# Altium schematic sheet DDR4.schdoc
size 492 x 319 mm
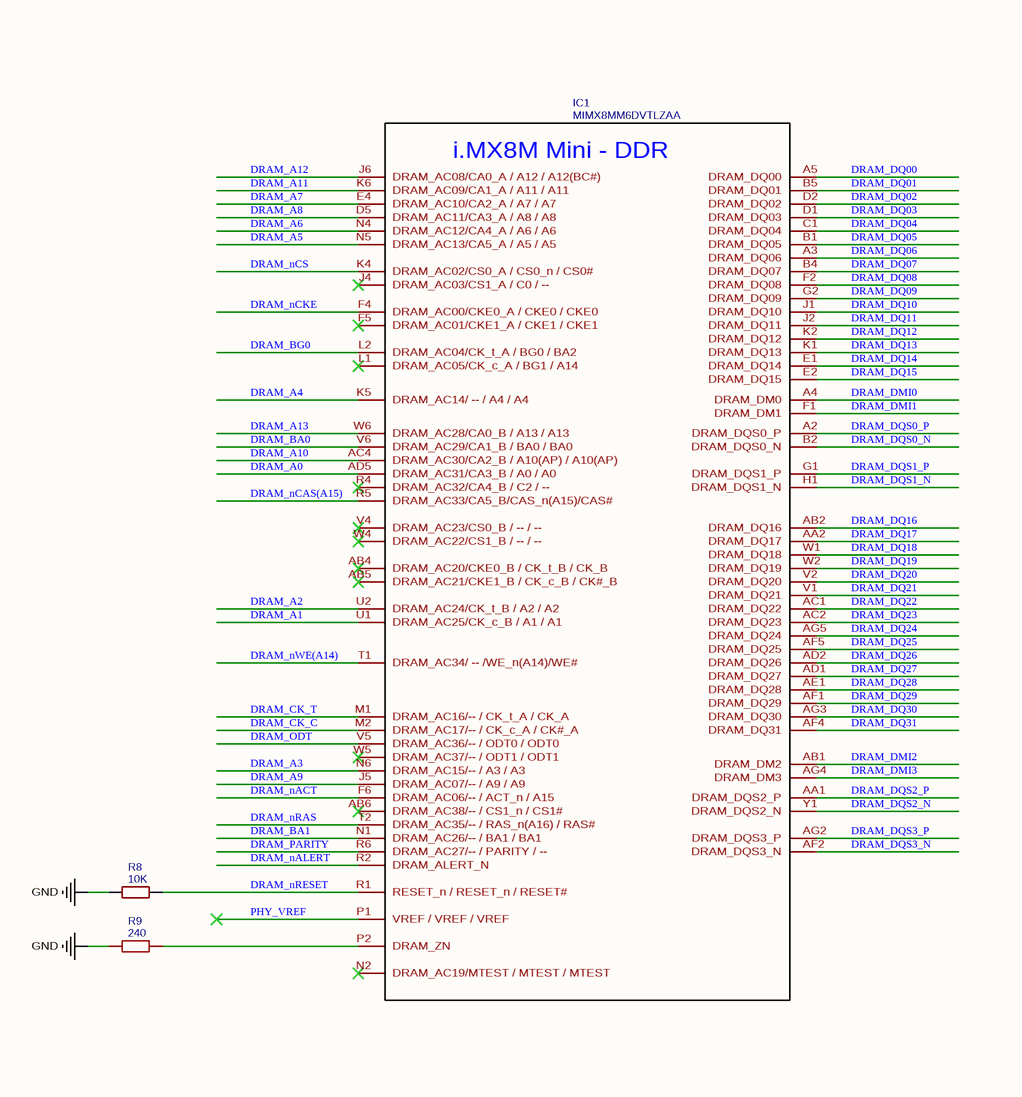
[diagram p0: DDR4.schdoc, left]
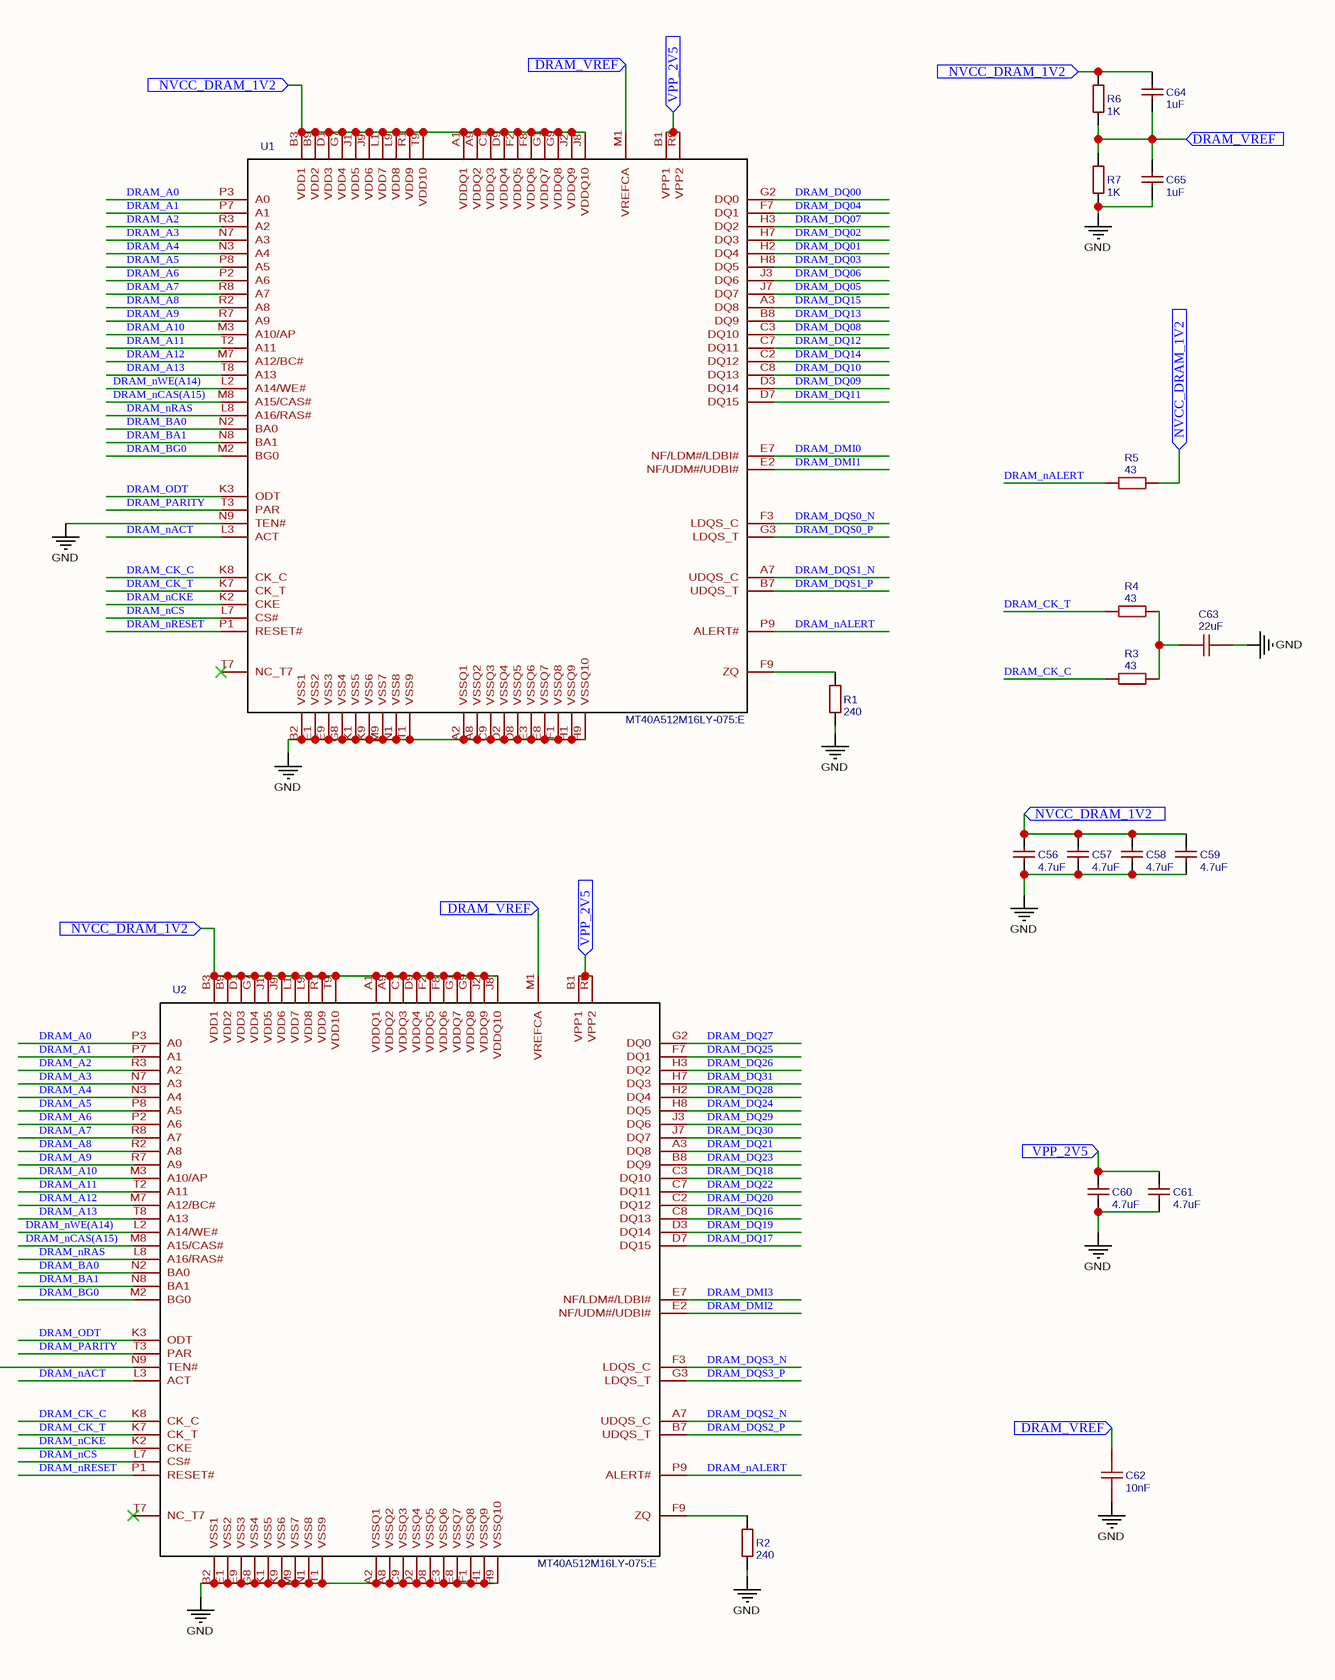
[diagram p1: DDR4.schdoc, right]

## Parts
C56  4.7uF  [C0402]
C57  4.7uF  [C0402]
C58  4.7uF  [C0402]
C59  4.7uF  [C0402]
C60  4.7uF  [C0402]
C61  4.7uF  [C0402]
C62  10nF  [C0603]
C63  22uF  [C0603]
C64  1uF  [C0402]
C65  1uF  [C0402]
IC1  MIMX8MM6DVTLZAA  [BGA486C50P27X27_1400X1400X125]
R1  240  [R0603]
R2  240  [R0603]
R3  43  [R0402]
R4  43  [R0402]
R5  43  [R0402]
R6  1K  [R0402]
R7  1K  [R0402]
R8  10K  [R0603]
R9  240  [R0402]
U1  MT40A512M16LY-075:E  [FBGA-96_L13.5-W7.5-R16-C6-P0.80-TL]
U2  MT40A512M16LY-075:E  [FBGA-96_L13.5-W7.5-R16-C6-P0.80-TL]

## Ports
DRAM_VREF (in), NVCC_DRAM_1V2 (in), VPP_2V5 (in)

## Nets
GND: C56.1 C57.1 C58.1 C59.1 C60.1 C61.1 C62.1 C63.2 C65.1 R1.1 R2.1 R7.1 R8.1 R9.1 U1.A2(VSSQ1) U1.A8(VSSQ2) U1.B2(VSS1) U1.C9(VSSQ3) U1.D2(VSSQ4) U1.D8(VSSQ5) U1.E1(VSS2) U1.E3(VSSQ6) U1.E8(VSSQ7) U1.E9(VSS3) U1.F1(VSSQ8) U1.G8(VSS4) U1.H1(VSSQ9) U1.H9(VSSQ10) U1.K1(VSS5) U1.K9(VSS6) U1.M9(VSS7) U1.N1(VSS8) U1.N9(TEN#) U1.T1(VSS9) U2.A2(VSSQ1) U2.A8(VSSQ2) U2.B2(VSS1) U2.C9(VSSQ3) U2.D2(VSSQ4) U2.D8(VSSQ5) U2.E1(VSS2) U2.E3(VSSQ6) U2.E8(VSSQ7) U2.E9(VSS3) U2.F1(VSSQ8) U2.G8(VSS4) U2.H1(VSSQ9) U2.H9(VSSQ10) U2.K1(VSS5) U2.K9(VSS6) U2.M9(VSS7) U2.N1(VSS8) U2.T1(VSS9)
DRAM_A0: IC1.AD5(DRAM_AC31/CA3_B_/_A0_/_A0) U1.P3(A0) U2.P3(A0)
DRAM_A1: IC1.U1(DRAM_AC25/CK_c_B_/_A1_/_A1) U1.P7(A1) U2.P7(A1)
DRAM_A2: IC1.U2(DRAM_AC24/CK_t_B_/_A2_/_A2) U1.R3(A2) U2.R3(A2)
DRAM_A3: IC1.N6(DRAM_AC15/--_/_A3_/_A3) U1.N7(A3) U2.N7(A3)
DRAM_A4: IC1.K5(DRAM_AC14/_--_/_A4_/_A4) U1.N3(A4) U2.N3(A4)
DRAM_A5: IC1.N5(DRAM_AC13/CA5_A_/_A5_/_A5) U1.P8(A5) U2.P8(A5)
DRAM_A6: IC1.N4(DRAM_AC12/CA4_A_/_A6_/_A6) U1.P2(A6) U2.P2(A6)
DRAM_A7: IC1.E4(DRAM_AC10/CA2_A_/_A7_/_A7) U1.R8(A7) U2.R8(A7)
DRAM_A8: IC1.D5(DRAM_AC11/CA3_A_/_A8_/_A8) U1.R2(A8) U2.R2(A8)
DRAM_A9: IC1.J5(DRAM_AC07/--_/_A9_/_A9) U1.R7(A9) U2.R7(A9)
DRAM_A10: IC1.AC4(DRAM_AC30/CA2_B_/_A10(AP)_/_A10(AP)) U1.M3(A10/AP) U2.M3(A10/AP)
DRAM_A11: IC1.K6(DRAM_AC09/CA1_A_/_A11_/_A11) U1.T2(A11) U2.T2(A11)
DRAM_A12: IC1.J6(DRAM_AC08/CA0_A_/_A12_/_A12(BC#)) U1.M7(A12/BC#) U2.M7(A12/BC#)
DRAM_A13: IC1.W6(DRAM_AC28/CA0_B_/_A13_/_A13) U1.T8(A13) U2.T8(A13)
DRAM_BA0: IC1.V6(DRAM_AC29/CA1_B_/_BA0_/_BA0) U1.N2(BA0) U2.N2(BA0)
DRAM_BA1: IC1.N1(DRAM_AC26/--_/_BA1_/_BA1) U1.N8(BA1) U2.N8(BA1)
DRAM_BG0: IC1.L2(DRAM_AC04/CK_t_A_/_BG0_/_BA2) U1.M2(BG0) U2.M2(BG0)
DRAM_CK_C: IC1.M2(DRAM_AC17/--_/_CK_c_A_/_CK#_A) R3.1 U1.K8(CK_C) U2.K8(CK_C)
DRAM_CK_T: IC1.M1(DRAM_AC16/--_/_CK_t_A_/_CK_A) R4.1 U1.K7(CK_T) U2.K7(CK_T)
DRAM_DMI0: IC1.A4(DRAM_DM0) U1.E7(NF/LDM#/LDBI#)
DRAM_DMI1: IC1.F1(DRAM_DM1) U1.E2(NF/UDM#/UDBI#)
DRAM_DMI2: IC1.AB1(DRAM_DM2) U2.E2(NF/UDM#/UDBI#)
DRAM_DMI3: IC1.AG4(DRAM_DM3) U2.E7(NF/LDM#/LDBI#)
DRAM_DQ00: IC1.A5(DRAM_DQ00) U1.G2(DQ0)
DRAM_DQ01: IC1.B5(DRAM_DQ01) U1.H2(DQ4)
DRAM_DQ02: IC1.D2(DRAM_DQ02) U1.H7(DQ3)
DRAM_DQ03: IC1.D1(DRAM_DQ03) U1.H8(DQ5)
DRAM_DQ04: IC1.C1(DRAM_DQ04) U1.F7(DQ1)
DRAM_DQ05: IC1.B1(DRAM_DQ05) U1.J7(DQ7)
DRAM_DQ06: IC1.A3(DRAM_DQ06) U1.J3(DQ6)
DRAM_DQ07: IC1.B4(DRAM_DQ07) U1.H3(DQ2)
DRAM_DQ08: IC1.F2(DRAM_DQ08) U1.C3(DQ10)
DRAM_DQ09: IC1.G2(DRAM_DQ09) U1.D3(DQ14)
DRAM_DQ10: IC1.J1(DRAM_DQ10) U1.C8(DQ13)
DRAM_DQ11: IC1.J2(DRAM_DQ11) U1.D7(DQ15)
DRAM_DQ12: IC1.K2(DRAM_DQ12) U1.C7(DQ11)
DRAM_DQ13: IC1.K1(DRAM_DQ13) U1.B8(DQ9)
DRAM_DQ14: IC1.E1(DRAM_DQ14) U1.C2(DQ12)
DRAM_DQ15: IC1.E2(DRAM_DQ15) U1.A3(DQ8)
DRAM_DQ16: IC1.AB2(DRAM_DQ16) U2.C8(DQ13)
DRAM_DQ17: IC1.AA2(DRAM_DQ17) U2.D7(DQ15)
DRAM_DQ18: IC1.W1(DRAM_DQ18) U2.C3(DQ10)
DRAM_DQ19: IC1.W2(DRAM_DQ19) U2.D3(DQ14)
DRAM_DQ20: IC1.V2(DRAM_DQ20) U2.C2(DQ12)
DRAM_DQ21: IC1.V1(DRAM_DQ21) U2.A3(DQ8)
DRAM_DQ22: IC1.AC1(DRAM_DQ22) U2.C7(DQ11)
DRAM_DQ23: IC1.AC2(DRAM_DQ23) U2.B8(DQ9)
DRAM_DQ24: IC1.AG5(DRAM_DQ24) U2.H8(DQ5)
DRAM_DQ25: IC1.AF5(DRAM_DQ25) U2.F7(DQ1)
DRAM_DQ26: IC1.AD2(DRAM_DQ26) U2.H3(DQ2)
DRAM_DQ27: IC1.AD1(DRAM_DQ27) U2.G2(DQ0)
DRAM_DQ28: IC1.AE1(DRAM_DQ28) U2.H2(DQ4)
DRAM_DQ29: IC1.AF1(DRAM_DQ29) U2.J3(DQ6)
DRAM_DQ30: IC1.AG3(DRAM_DQ30) U2.J7(DQ7)
DRAM_DQ31: IC1.AF4(DRAM_DQ31) U2.H7(DQ3)
DRAM_DQS0_N: IC1.B2(DRAM_DQS0_N) U1.F3(LDQS_C)
DRAM_DQS0_P: IC1.A2(DRAM_DQS0_P) U1.G3(LDQS_T)
DRAM_DQS1_N: IC1.H1(DRAM_DQS1_N) U1.A7(UDQS_C)
DRAM_DQS1_P: IC1.G1(DRAM_DQS1_P) U1.B7(UDQS_T)
DRAM_DQS2_N: IC1.Y1(DRAM_DQS2_N) U2.A7(UDQS_C)
DRAM_DQS2_P: IC1.AA1(DRAM_DQS2_P) U2.B7(UDQS_T)
DRAM_DQS3_N: IC1.AF2(DRAM_DQS3_N) U2.F3(LDQS_C)
DRAM_DQS3_P: IC1.AG2(DRAM_DQS3_P) U2.G3(LDQS_T)
DRAM_nACT: IC1.F6(DRAM_AC06/--_/_ACT_n_/_A15) U1.L3(ACT) U2.L3(ACT)
DRAM_nALERT: IC1.R2(DRAM_ALERT_N) R5.1 U1.P9(ALERT#) U2.P9(ALERT#)
DRAM_nCAS(A15): IC1.R5(DRAM_AC33/CA5_B/CAS_n(A15)/CAS#) U1.M8(A15/CAS#) U2.M8(A15/CAS#)
DRAM_nCKE: IC1.F4(DRAM_AC00/CKE0_A_/_CKE0_/_CKE0) U1.K2(CKE) U2.K2(CKE)
DRAM_nCS: IC1.K4(DRAM_AC02/CS0_A_/_CS0_n_/_CS0#) U1.L7(CS#) U2.L7(CS#)
DRAM_nRAS: IC1.T2(DRAM_AC35/--_/_RAS_n(A16)_/_RAS#) U1.L8(A16/RAS#) U2.L8(A16/RAS#)
DRAM_nRESET: IC1.R1(RESET_n_/_RESET_n_/_RESET#) R8.2 U1.P1(RESET#) U2.P1(RESET#)
DRAM_nWE(A14): IC1.T1(DRAM_AC34/_--_/WE_n(A14)/WE#) U1.L2(A14/WE#) U2.L2(A14/WE#)
DRAM_ODT: IC1.V5(DRAM_AC36/--_/_ODT0_/_ODT0) U1.K3(ODT) U2.K3(ODT)
DRAM_PARITY: IC1.R6(DRAM_AC27/--_/_PARITY_/_--) U1.T3(PAR) U2.T3(PAR)
DRAM_VREF: C62.2 C64.1 C65.2 R6.1 R7.2 U1.M1(VREFCA) U2.M1(VREFCA) ; port DRAM_VREF
NVCC_DRAM_1V2: C56.2 C57.2 C58.2 C59.2 C64.2 R5.2 R6.2 U1.A1(VDDQ1) U1.A9(VDDQ2) U1.B3(VDD1) U1.B9(VDD2) U1.C1(VDDQ3) U1.D1(VDD3) U1.D9(VDDQ4) U1.F2(VDDQ5) U1.F8(VDDQ6) U1.G1(VDDQ7) U1.G7(VDD4) U1.G9(VDDQ8) U1.J1(VDD5) U1.J2(VDDQ9) U1.J8(VDDQ10) U1.J9(VDD6) U1.L1(VDD7) U1.L9(VDD8) U1.R1(VDD9) U1.T9(VDD10) U2.A1(VDDQ1) U2.A9(VDDQ2) U2.B3(VDD1) U2.B9(VDD2) U2.C1(VDDQ3) U2.D1(VDD3) U2.D9(VDDQ4) U2.F2(VDDQ5) U2.F8(VDDQ6) U2.G1(VDDQ7) U2.G7(VDD4) U2.G9(VDDQ8) U2.J1(VDD5) U2.J2(VDDQ9) U2.J8(VDDQ10) U2.J9(VDD6) U2.L1(VDD7) U2.L9(VDD8) U2.R1(VDD9) U2.T9(VDD10) ; port NVCC_DRAM_1V2
PHY_VREF: IC1.P1(VREF_/_VREF_/_VREF)
VPP_2V5: C60.2 C61.2 U1.B1(VPP1) U1.R9(VPP2) U2.B1(VPP1) U2.R9(VPP2) ; port VPP_2V5
NetC63_1: C63.1 R3.2 R4.2
NetIC1_P2: IC1.P2(DRAM_ZN) R9.2
NetR1_2: R1.2 U1.F9(ZQ)
NetR2_2: R2.2 U2.F9(ZQ)

Not connected (* = marked no-connect by the designer): IC1 AB4(DRAM_AC20/CKE0_B_/_CK_t_B_/_CK_B)* AB5(DRAM_AC21/CKE1_B_/_CK_c_B_/_CK#_B)* AB6(DRAM_AC38/--_/_CS1_n_/_CS1#)* F5(DRAM_AC01/CKE1_A_/_CKE1_/_CKE1)* J4(DRAM_AC03/CS1_A_/_C0_/_--)* L1(DRAM_AC05/CK_c_A_/_BG1_/_A14)* N2(DRAM_AC19/MTEST_/_MTEST_/_MTEST)* R4(DRAM_AC32/CA4_B_/_C2_/_--)* V4(DRAM_AC23/CS0_B_/_--_/_--)* W4(DRAM_AC22/CS1_B_/_--_/_--)* W5(DRAM_AC37/--_/_ODT1_/_ODT1)*; U1 T7(NC_T7)*; U2 N9(TEN#) T7(NC_T7)*

## Notes on the sheet
- (in symbol MIMX8MM6DVTLZAA) i.MX8M Mini - DDR

## Library data of the parts
C56-C61 = 4.7uF: BOM_Manufacturer Part: CL05A475MP5NRNC; BOM_Manufacturer: SAMSUNG; nameAlias: Capacitance; SMT Type: Basic; BOM_Supplier: LCSC; BOM_Supplier Part: C23733; BOM_JLCPCB SMD: Yes; spicePre: C; spiceSymbolName: CL05A475MP5NRNC
C62 = 10nF: BOM_Manufacturer: SAMSUNG; BOM_Manufacturer Part: CL10B103JB8NNNC; nameAlias: Capacitance; SMT Type: Extend; BOM_Supplier: LCSC; BOM_Supplier Part: C7248; BOM_JLCPCB SMD: Yes; spicePre: C; spiceSymbolName: CL10B103JB8NNNC
C63 = 22uF: BOM_Manufacturer: SAMSUNG; BOM_Manufacturer Part: CL10A226MQ8NRNC; nameAlias: Capacitance; SMT Type: Basic; BOM_Supplier: LCSC; BOM_Supplier Part: C59461; BOM_JLCPCB SMD: Yes; spicePre: C; spiceSymbolName: CL10A226MQ8NRNC
C64 C65 = 1uF: BOM_Manufacturer Part: CL05A105KP5NNNC; BOM_Manufacturer: SAMSUNG; nameAlias: Capacitance; SMT Type: Extend; BOM_Supplier: LCSC; BOM_Supplier Part: C14445; BOM_JLCPCB SMD: Yes; spicePre: C; spiceSymbolName: CL05A105KP5NNNC
IC1 = MIMX8MM6DVTLZAA: subpart_no: 2; Contributor: Ke'Ondrae_Mell; spicePre: I; spiceSymbolName: MIMX8MM6DVTLZAA
R1 R2 = 240: BOM_Manufacturer: UniOhm; BOM_Manufacturer Part: 0603WAF2400T5E; nameAlias: Resistance (Ohms); SMT Type: Basic; BOM_Supplier: LCSC; BOM_Supplier Part: C23350; BOM_JLCPCB SMD: Yes; spicePre: R; spiceSymbolName: 0603WAF2400T5E
R3-R5 = 43: BOM_Manufacturer: Uniroyal Elec; BOM_Manufacturer Part: 0402WGF430JTCE; nameAlias: Resistance (Ohms); Contributor: LCSC; SMT Type: Extend; BOM_Supplier: LCSC; BOM_Supplier Part: C270600; BOM_JLCPCB SMD: Yes; spicePre: R; spiceSymbolName: 0402WGF430JTCE
R6 R7 = 1K: BOM_Manufacturer: UniOhm; BOM_Manufacturer Part: 0402WGF1001TCE; nameAlias: Resistance (Ohms); SMT Type: Basic; BOM_Supplier: LCSC; BOM_Supplier Part: C11702; BOM_JLCPCB SMD: Yes; spicePre: R; spiceSymbolName: 0402WGF1001TCE
R8 = 10K: BOM_Manufacturer: UniOhm; BOM_Manufacturer Part: LE03WAJ0103T5E; nameAlias: Resistance (Ohms); SMT Type: Extend; BOM_Supplier: LCSC; BOM_Supplier Part: C81087; BOM_JLCPCB SMD: Yes; spicePre: R; spiceSymbolName: LE03WAJ0103T5E
R9 = 240: BOM_Manufacturer: Uniroyal Elec; BOM_Manufacturer Part: NQ02WGF2400TCE; nameAlias: Resistance (Ohms); Contributor: LCSC; SMT Type: Extend; BOM_Supplier: LCSC; BOM_Supplier Part: C270375; BOM_JLCPCB SMD: Yes; spicePre: R; spiceSymbolName: NQ02WGF2400TCE
U1 U2 = MT40A512M16LY-075:E: BOM_Manufacturer: Micron Tech; Contributor: Ke'Ondrae_Mell; BOM_Supplier: LCSC; BOM_Supplier Part: C598779; BOM_Manufacturer Part: MT40A512M16LY-075:E; spicePre: U; spiceSymbolName: MT40A512M16LY-075:E